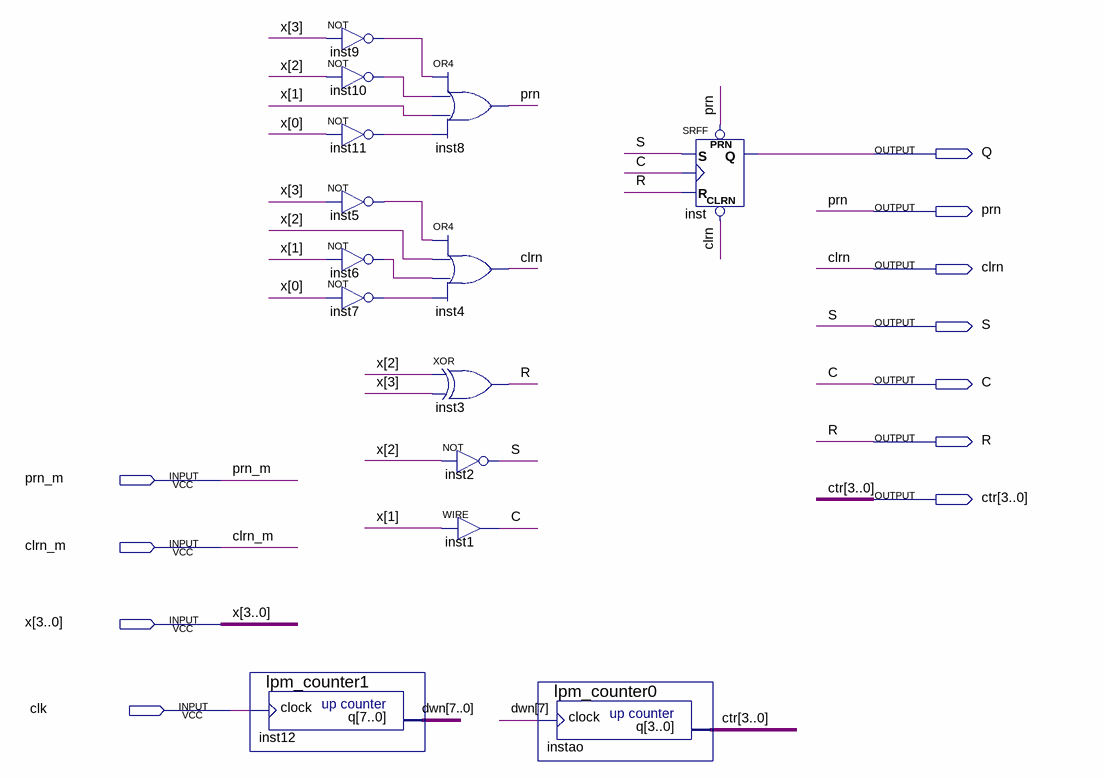
[diagram p0: schematic sheet]
// Quartus schematic lab4RS.bdf as structural Verilog: 14 symbols, 11 pins
module lab4RS (
  input  prn_m,
  input  clrn_m,
  input  [3:0] x,
  input  clk,
  output Q,
  output prn,
  output clrn,
  output S,
  output C,
  output R,
  output [3:0] ctr
);

  wire inst5_out, inst6_out, inst7_out, inst9_out, inst10_out, inst11_out;
  wire [7:0] dwn;

  lpm_counter1 inst12 (.clock(clk), .q(dwn));
  not inst9 (inst9_out, x[3]);
  not inst10 (inst10_out, x[2]);
  not inst11 (inst11_out, x[0]);
  not inst5 (inst5_out, x[3]);
  not inst6 (inst6_out, x[1]);
  not inst7 (inst7_out, x[0]);
  or inst8 (prn, inst9_out, inst10_out, x[1], inst11_out);
  or inst4 (clrn, inst5_out, x[2], inst6_out, inst7_out);
  xor inst3 (R, x[2], x[3]);
  not inst2 (S, x[2]);
  assign C = x[1];  // WIRE inst1
  lpm_counter0 instao (.clock(dwn[7]), .q(ctr));
  SRFF inst (.PRN(prn), .CLRN(clrn), .S(S), .R(R), .CLK(C), .Q(Q));
endmodule
